# Altium schematic sheet Port.SchDoc
size 127 x 177 mm; SheetNumber: 4; SheetTotal: 5
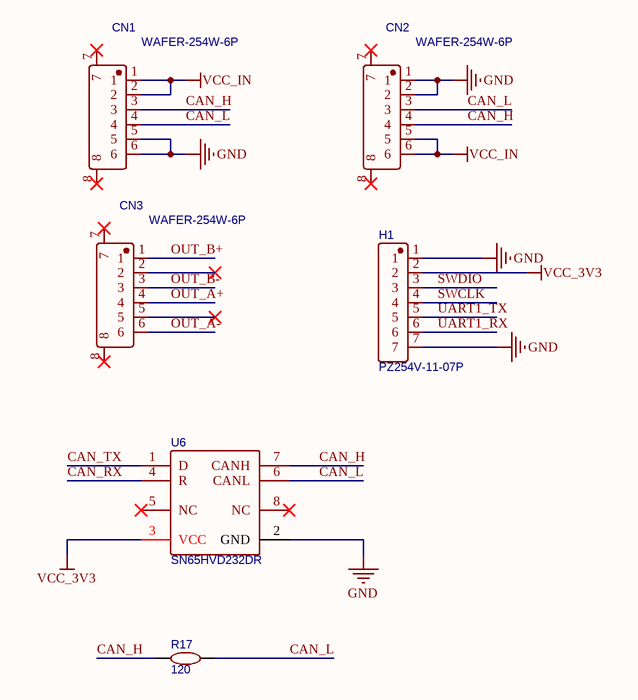
[diagram p0: Port.SchDoc]

## Parts
CN1  WAFER-254W-6P  [CONN-SMD_WAFER-254W-6P]
CN2  WAFER-254W-6P  [CONN-SMD_WAFER-254W-6P]
CN3  WAFER-254W-6P  [CONN-SMD_WAFER-254W-6P]
H1  PZ254V-11-07P  [HDR-TH_7P-P2.54-V-M]
R17  120  [R0603]
U6  SN65HVD232DR  [SOIC-8_L5.0-W4.0-P1.27-LS6.0-BL]

## Nets
GND: CN1.5 CN1.6 CN2.1 CN2.2 H1.1 H1.7 U6.2(GND)
VCC_3V3: H1.2 U6.3(VCC)
VCC_IN: CN1.1 CN1.2 CN2.5 CN2.6
CAN_H: CN1.3 CN2.4 R17.1 U6.7(CANH)
CAN_L: CN1.4 CN2.3 R17.2 U6.6(CANL)
CAN_RX: U6.4(R)
CAN_TX: U6.1(D)
OUT_A+: CN3.4
OUT_A-: CN3.6
OUT_B+: CN3.1
OUT_B-: CN3.3
SWCLK: H1.4
SWDIO: H1.3
UART1_RX: H1.6
UART1_TX: H1.5

Not connected (* = marked no-connect by the designer): CN1 7* 8*; CN2 7* 8*; CN3 2* 5* 7* 8*; U6 5(NC)* 8(NC)*

## Library data of the parts
CN1-CN3 = WAFER-254W-6P: BOM_Manufacturer: XUNPU(讯普); Contributor: LCSC; BOM_Supplier: LCSC; BOM_Supplier Part: C2856747; BOM_Manufacturer Part: WAFER-254W-6P; spicePre: C; spiceSymbolName: WAFER-254W-6P
H1 = PZ254V-11-07P: BOM_Manufacturer: XFCN; Contributor: LCSC; BOM_Supplier: LCSC; BOM_Supplier Part: C492406; BOM_Manufacturer Part: PZ254V-11-07P; BOM_JLCPCB Part Class: Extended Part; spicePre: H; spiceSymbolName: PZ254V-11-07P
R17 = 120: BOM_Manufacturer: UniOhm; BOM_Manufacturer Part: 0603WAF1200T5E; nameAlias: Resistance (Ohms); BOM_Supplier: LCSC; BOM_Supplier Part: C22787; BOM_JLCPCB Part Class: Basic Part; spicePre: R; spiceSymbolName: 0603WAF1200T5E
U6 = SN65HVD232DR: BOM_Manufacturer: TI; BOM_Supplier: LCSC; BOM_Manufacturer Part: SN65HVD232DR; BOM_Supplier Part: C30530; BOM_JLCPCB Part Class: Extended Part; spicePre: U; spiceSymbolName: SN65HVD232DR